# Altium schematic sheet USB4105.SchDoc
size A4; SheetNumber: 2; SheetTotal: 8
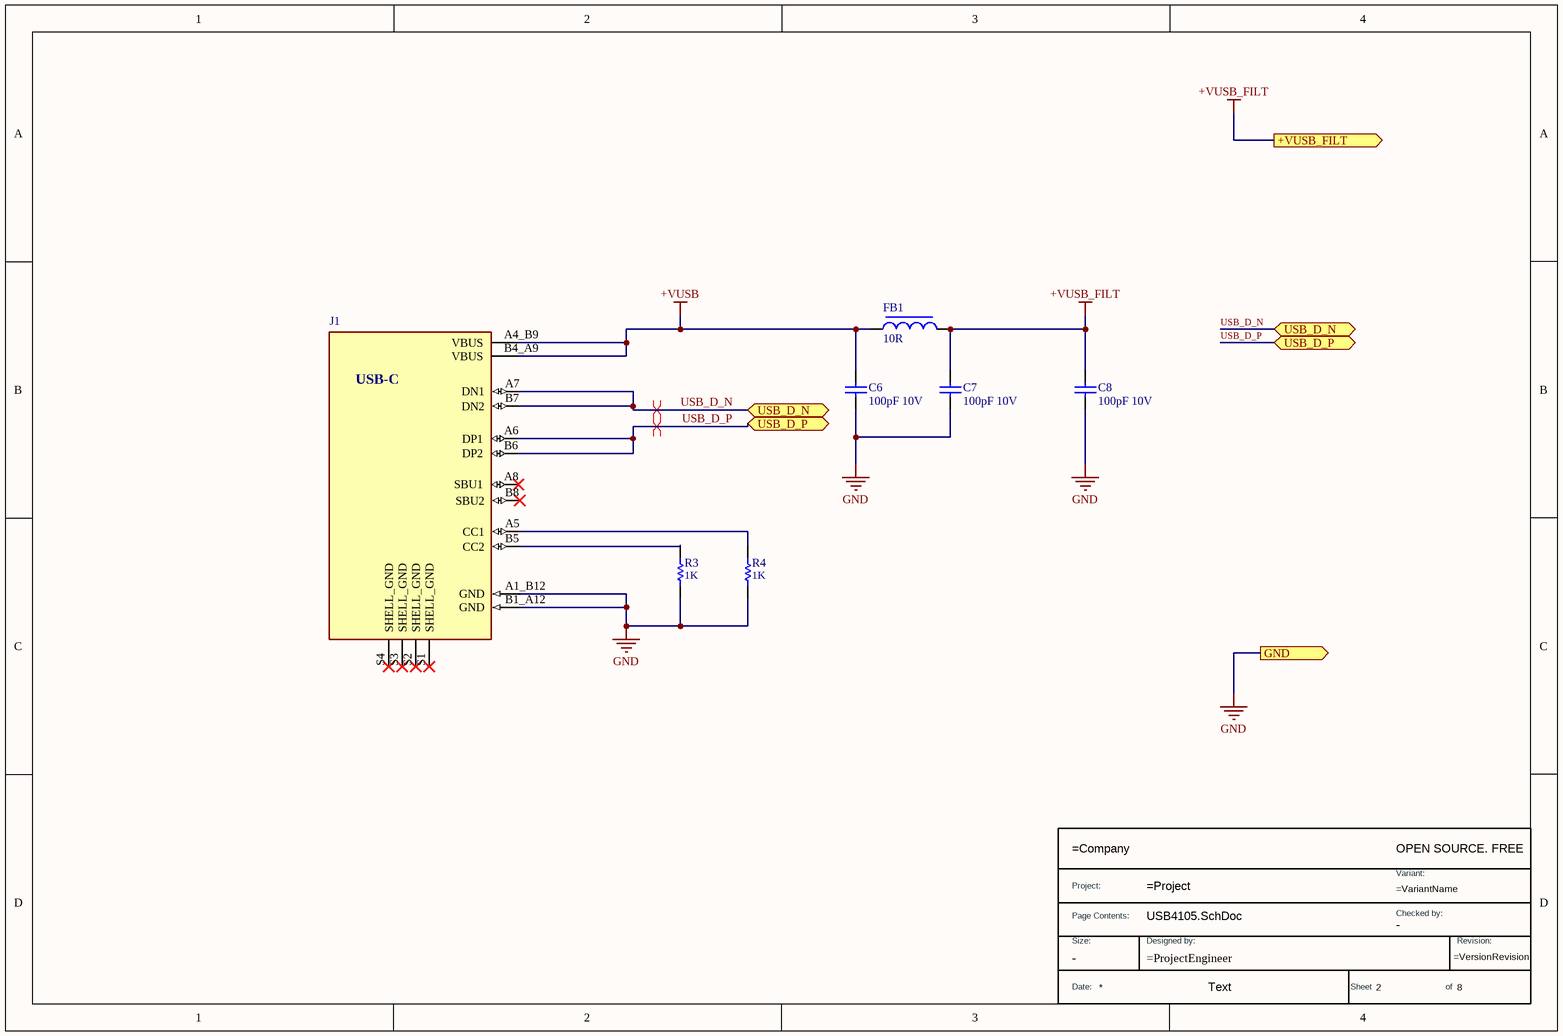
[diagram p0: USB4105.SchDoc]

## Parts
*  TitleBlock  (value not drawn)  (graphical)
C6  value 100pF 10V  (hidden comment: _Capacitor)
C7  value 100pF 10V  (hidden comment: _Capacitor)
C8  value 100pF 10V  (hidden comment: _Capacitor)
FB1  value 10R  (hidden comment: _FERRITE)
J1  USB4105-GF-A  [GCT_USB4105-GF-A]  (value not drawn)
R3  value 1K  (hidden comment: _Resistor)
R4  value 1K  (hidden comment: _Resistor)

## Ports
+VUSB_FILT (out, see 1[3B], 3[1A]), GND (out, see 1[3C], 3[1A], 4[1A]), USB_D_N (bidir, see 1[3B]), USB_D_P (bidir, see 1[3B])

## Nets
+VUSB: C6.2 FB1.1 J1.A4_B9(VBUS) J1.B4_A9(VBUS)
+VUSB_FILT: C7.2 C8.2 FB1.2 ; port +VUSB_FILT
GND: C6.1 C7.1 C8.1 J1.A1_B12(GND) J1.B1_A12(GND) R3.1 R4.1 ; port GND
USB_D_N: J1.A7(DN1) J1.B7(DN2) ; port USB_D_N
USB_D_P: J1.A6(DP1) J1.B6(DP2) ; port USB_D_P
NetJ1_A5: J1.A5(CC1) R4.2
NetJ1_B5: J1.B5(CC2) R3.2

Not connected (* = marked no-connect by the designer): J1 A8(SBU1)* B8(SBU2)* S1(SHELL_GND)* S2(SHELL_GND)* S3(SHELL_GND)* S4(SHELL_GND)*

## Layout directives
differential pair; differential pair class USB: USB_D_N, USB_D_P

## Notes on the sheet
- Todas as informações e detalhes técnicos deste documento são de inteira propriedade da empresa V2COM,
- não poderão ser copiados, reduzidos ou cedidos a terceiros sem prévia autorização por escrito da mesma.
- Salvo em (D/M/A):
- Página:
- de
- Nome do Projeto:
- https://v2com.com/
- Ed.:
- Responsável:
- Nome da página:
- Rev.:
- Projetista:
- Obs.:
- Revisor:
- Arquivo:
- -
- (in symbol TitleBlock) OPEN SOURCE. FREE; Project:; Variant:; Page Contents:; Checked by:; Size:; Designed by:; Revision:; Date:; Text; Sheet; of
- (in symbol USB4105-GF-A) USB-C

## Library data of the parts
* = TitleBlock: Standard Title Block; DWG NO: =ProjectEngineer; Size: -; Checked by: -
C6-C8 = _Capacitor: Capacitor; Published: 8-Jun-2000; LatestRevisionDate: 17-Jul-2002; LatestRevisionNote: Re-released for DXP Platform.; PackageReference: RAD-0.3; Publisher: Altium Limited; PackageDescription: Radial Cap, Thru-Hole; 2 Leads; 0.3 in Pin Spacing
FB1 = _FERRITE: Ferrite Bead; Code_IEC: 1005; Published: 8-Jun-2000; LatestRevisionDate: 29-May-2009; LatestRevisionNote: IPC-7351 Footprint Added.; PackageReference: 0402-A; Publisher: Altium Limited; PackageDescription: Chip Inductor; Code_JEITA: 0402
J1 = USB4105-GF-A: USB-C (USB TYPE-C) USB 2.0 Receptacle Connector 24 (16+8 Dummy) Position Surface Mount, Right Angle; Through Hole; MF: GCT; Price: None; Availability: In Stock; MP: USB4105-GF-A; Package: None; SnapEDA_Link: https://www.snapeda.com/parts/USB4105-GF-A/Global+Connector+Technology/view-part/?ref=snap; Check_prices: https://www.snapeda.com/parts/USB4105-GF-A/Global+Connector+Technology/view-part/?ref=eda; Value: *; Purchase-URL: https://pricing.snapeda.com/search/part/USB4105-GF-A/?ref=eda
R3 R4 = _Resistor: Resistor; Published: 8-Jun-2000; LatestRevisionDate: 17-Jul-2002; LatestRevisionNote: Re-released for DXP Platform.; PackageReference: AXIAL-0.3; Publisher: Altium Limited; PackageDescription: Axial Device, Thru-Hole; 2 Leads; 0.3 in Pin Spacing